# Altium schematic sheet ControllerDSP.SchDoc
size 594 x 420 mm; Address1: Address1; Address2: Address2; Address3: Address3; Address4: Address4; DocumentNumber: АБВГ.123456.001 Э3; SheetNumber: 1; SheetTotal: 5; Scale: 1:1; DocumentType: Схема электрическая принципиальная; FirstReferrence: АБВГ.123456.001
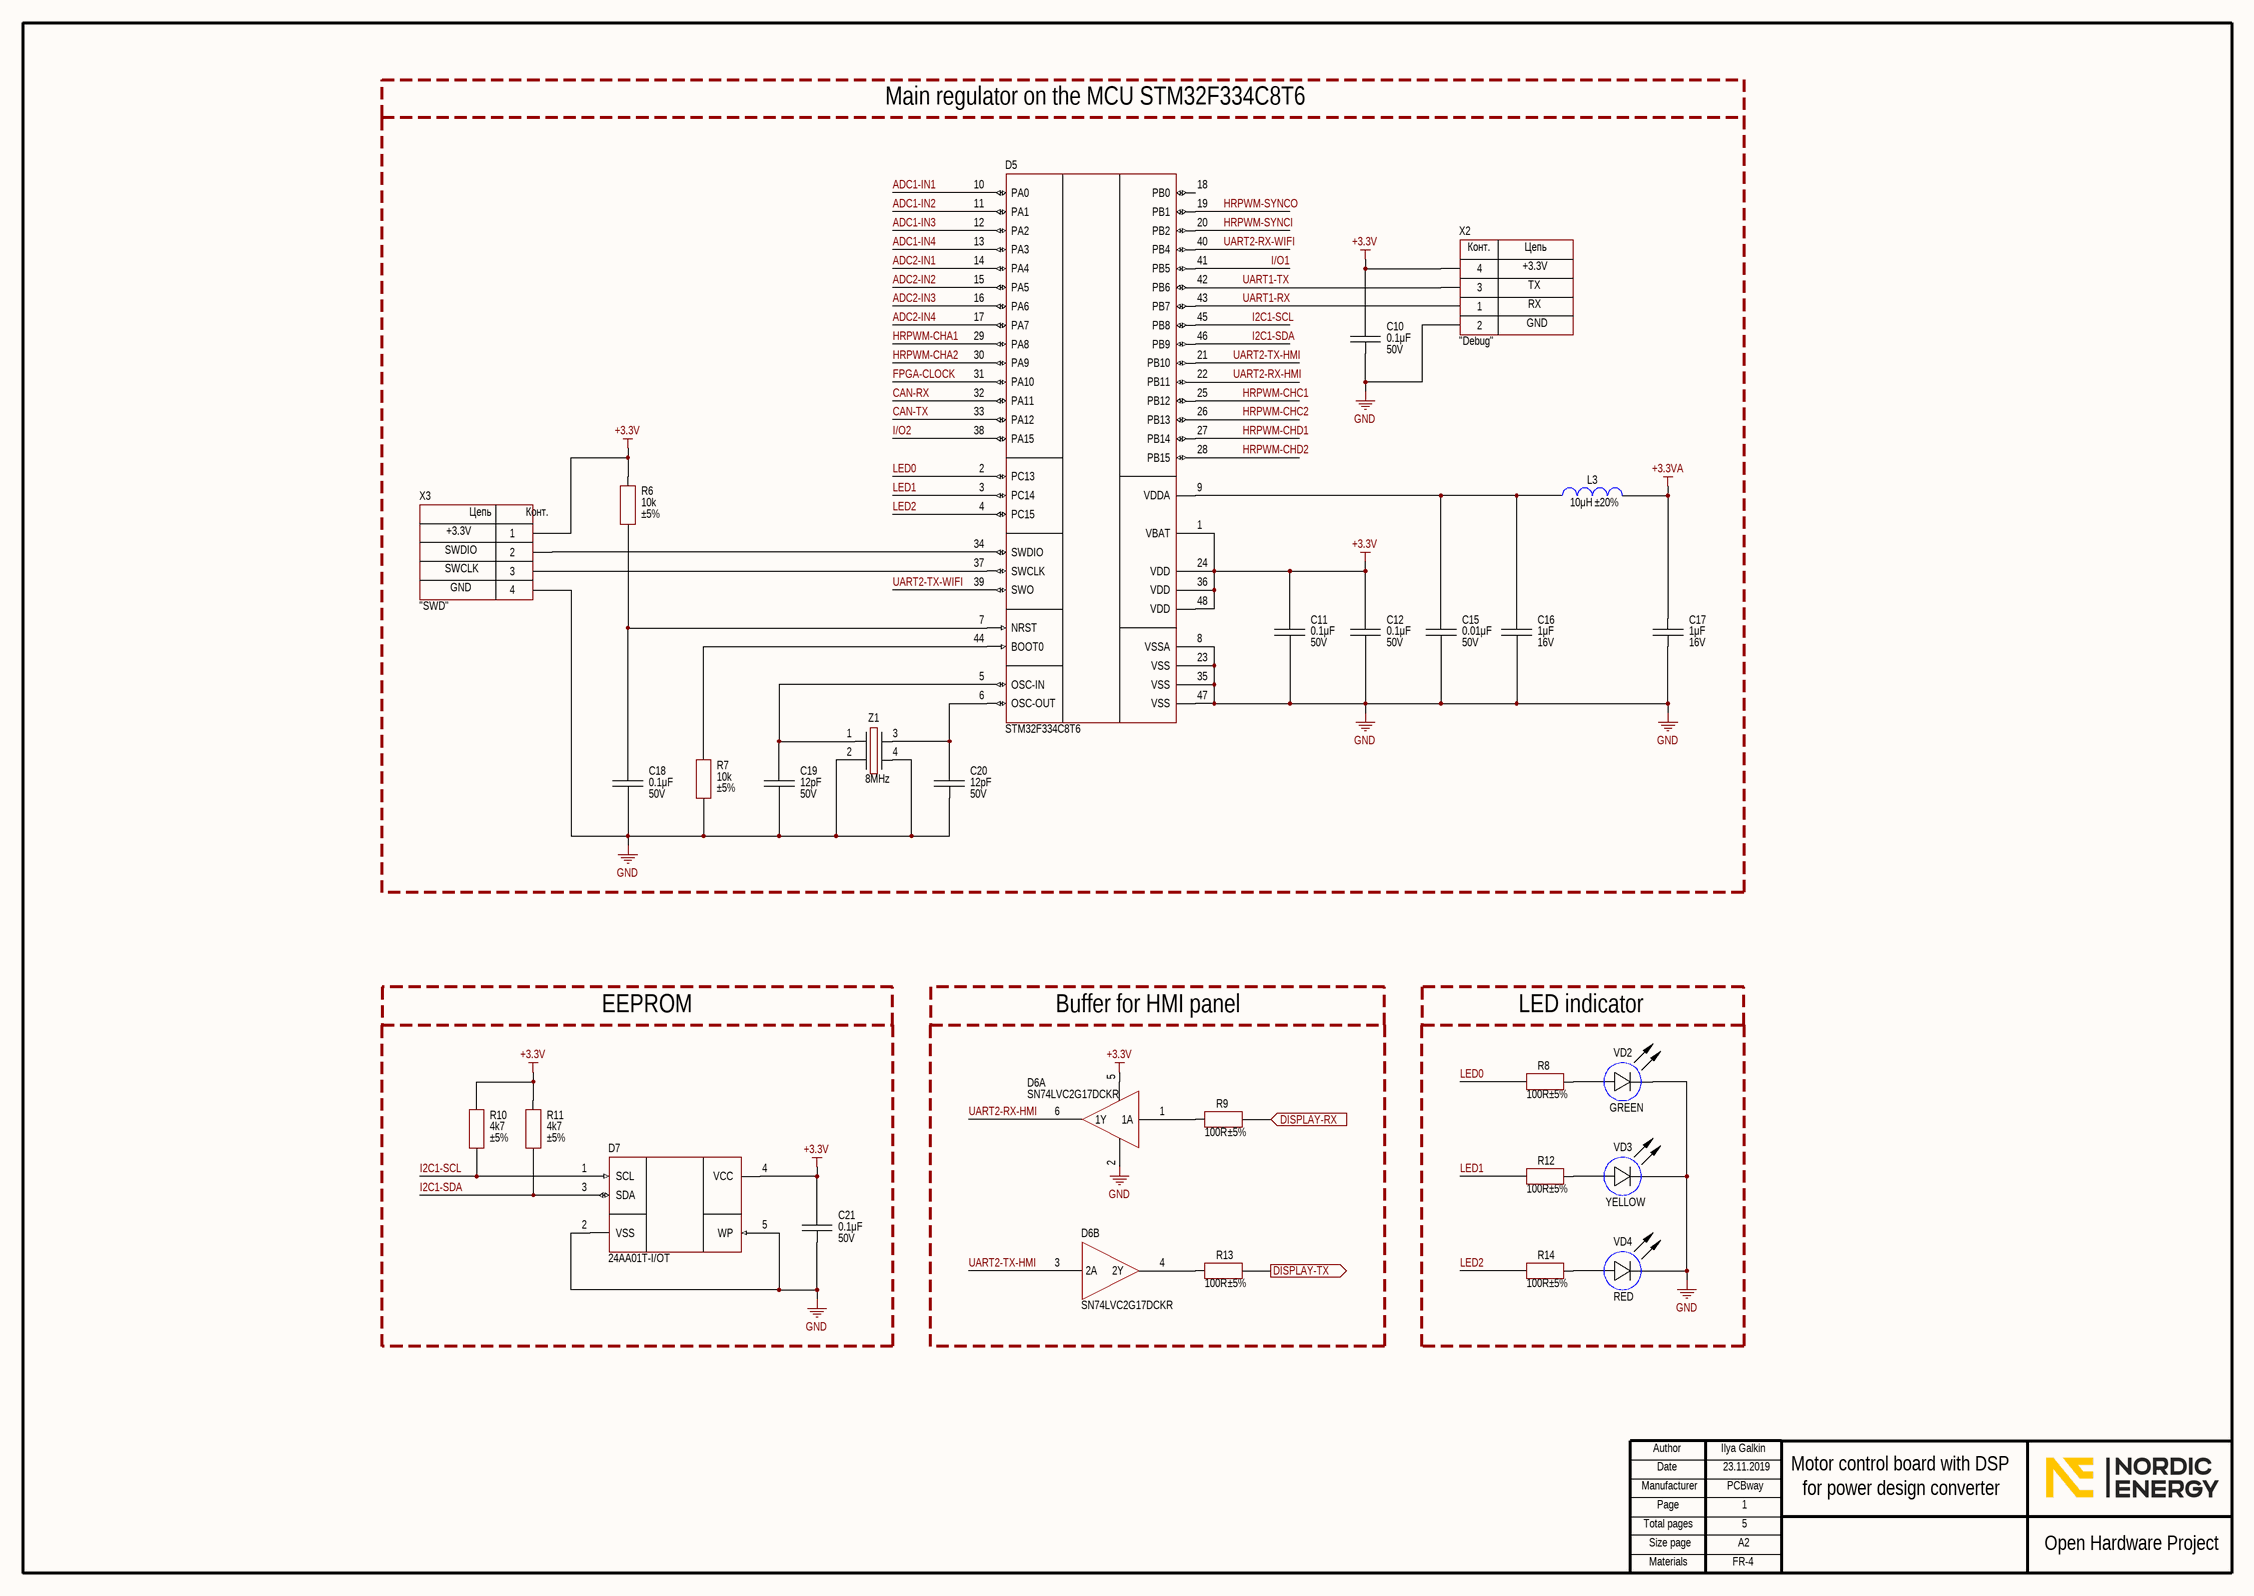
[diagram p0: ControllerDSP.SchDoc]

## Parts
C10  value 0.1μF  Voltage: 50V  [CAP: 0603]
C11  value 0.1μF  Voltage: 50V  [CAP: 0603]
C12  value 0.1μF  Voltage: 50V  [CAP: 0603]
C15  value 0.01μF  Voltage: 50V  [CAP: 0603]
C16  value 1μF  Voltage: 16V  [CAP: 0603]
C17  value 1μF  Voltage: 16V  [CAP: 0603]
C18  value 0.1μF  Voltage: 50V  [CAP: 0603]
C19  value 12pF  Voltage: 50V  [CAP: 0603]
C20  value 12pF  Voltage: 50V  [CAP: 0603]
C21  value 0.1μF  Voltage: 50V  [CAP: 0603]
D5  (no value)  [48-LQFP]
D6  (no value)  [SC70-6]  (parts A,B of 2)
D7  PartNumber: 24AA01T-I/OT  [SOT23-5]
L3  value 10μH  Tolerance: ±20%  [IND: 0603]
R6  value 10k  Tolerance: ±5%  [RES: 0603]
R7  value 10k  Tolerance: ±5%  [RES: 0603]
R8  value 100R  Tolerance: ±5%  [RES: 0603]
R9  value 100R  Tolerance: ±5%  [RES: 0603]
R10  value 4k7  Tolerance: ±5%  [RES: 0603]
R11  value 4k7  Tolerance: ±5%  [RES: 0603]
R12  value 100R  Tolerance: ±5%  [RES: 0603]
R13  value 100R  Tolerance: ±5%  [RES: 0603]
R14  value 100R  Tolerance: ±5%  [RES: 0603]
VD2  Color: GREEN  [LED: 0603G]
VD3  Color: YELLOW  [LED: 0603Y]
VD4  Color: RED  [LED: 0603R]
X2  CommentText: "Debug"  [CON: PBD-4]
X3  CommentText: "SWD"  [CON: SM04B-GHS]
Z1  Frequency: 8MHz  [OSC: 3225]

## Blocks framed on the sheet
Main regulator on the MCU STM32F334C8T6: C10-C12 C15-C20 D5 L3 R6 R7 X2 X3 Z1
EEPROM: C21 D7 R10 R11
Buffer for HMI panel: D6 R9 R13
LED indicator: R8 R12 R14 VD2-VD4

## Ports
DISPLAY-RX (in), DISPLAY-TX (out)

## Nets
+3.3V: C10.2 C11.2 C12.2 C21.2 D5.1(VBAT) D5.24(VDD) D5.36(VDD) D5.48(VDD) D6.5 D7.4(VCC) R6.2 R10.2 R11.2 X2.4 X3.1
+3.3VA: C17.2 L3.1
GND: C10.1 C11.1 C12.1 C15.1 C16.1 C17.1 C18.1 C19.1 C20.1 C21.1 D5.8(VSSA) D5.23(VSS) D5.35(VSS) D5.47(VSS) D6.2 D7.2(VSS) D7.5(WP) R7.1 VD2.2(C) VD3.2(C) VD4.2(C) X2.2 X3.4 Z1.2 Z1.4
ADC1-IN1: D5.10(PA0)
ADC1-IN2: D5.11(PA1)
ADC1-IN3: D5.12(PA2)
ADC1-IN4: D5.13(PA3)
ADC2-IN1: D5.14(PA4)
ADC2-IN2: D5.15(PA5)
ADC2-IN3: D5.16(PA6)
ADC2-IN4: D5.17(PA7)
CAN-RX: D5.32(PA11)
CAN-TX: D5.33(PA12)
DISPLAY-RX: R9.2 ; port DISPLAY-RX
DISPLAY-TX: R13.2 ; port DISPLAY-TX
FPGA-CLOCK: D5.31(PA10)
HRPWM-CHA1: D5.29(PA8)
HRPWM-CHA2: D5.30(PA9)
HRPWM-CHC1: D5.25(PB12)
HRPWM-CHC2: D5.26(PB13)
HRPWM-CHD1: D5.27(PB14)
HRPWM-CHD2: D5.28(PB15)
HRPWM-SYNCI: D5.20(PB2)
HRPWM-SYNCO: D5.19(PB1)
I2C1-SCL: D5.45(PB8) D7.1(SCL) R10.1
I2C1-SDA: D5.46(PB9) D7.3(SDA) R11.1
I/O1: D5.41(PB5)
I/O2: D5.38(PA15)
LED0: D5.2(PC13) R8.1
LED1: D5.3(PC14) R12.1
LED2: D5.4(PC15) R14.1
UART1-RX: D5.43(PB7) X2.1
UART1-TX: D5.42(PB6) X2.3
UART2-RX-HMI: D5.22(PB11) D6.6(1Y)
UART2-RX-WIFI: D5.40(PB4)
UART2-TX-HMI: D5.21(PB10) D6.3(2A)
UART2-TX-WIFI: D5.39(SWO)
NetC15_2: C15.2 C16.2 D5.9(VDDA) L3.2
NetC18_2: C18.2 D5.7(NRST) R6.1
NetC19_2: C19.2 D5.5(OSC-IN) Z1.1
NetC20_2: C20.2 D5.6(OSC-OUT) Z1.3
NetD5_34: D5.34(SWDIO) X3.2
NetD5_37: D5.37(SWCLK) X3.3
NetD5_44: D5.44(BOOT0) R7.2
NetD6_1: D6.1(1A) R9.1
NetD6_4: D6.4(2Y) R13.1
NetR8_2: R8.2 VD2.1(A)
NetR12_2: R12.2 VD3.1(A)
NetR14_2: R14.2 VD4.1(A)

Not connected (* = marked no-connect by the designer): D5 18(PB0)

## Notes on the sheet
- SWDIO
- +3.3V
- SWCLK
- GND
- Ilya Galkin
- 23.11.2019
- PCBway
- 1
- Motor control board with DSP
- for power design converter
- 5
- FR-4
- Author
- Manufacturer
- Date
- Page
- Total pages
- Size page
- A2
- Open Hardware Project
- Materials
- (in symbol Connector_SM04B) Цепь; Конт.
- (in symbol Standard_Debug) Конт.; Цепь; +3.3V; TX; RX; GND

## Library data of the parts
C10-C12 C18 C21 = Ceramic_0603: Manufacturer: Samsung; PartNumber: CL10B104KB8NNNC; ValueManufacturerPartNumber: Ceramic capacitor, 0.1μF, X7R, ±10%, 50V, 0603, -55...+125°C; TypeCapacitor: Ceramic capacitor; Tolerance: ±10%; TypeDielectric: X7R; Package: 0603; HelpURL: https://www.digikey.com/product-detail/en/samsung-electro-mechanics/CL10B104KB8NNNC/1276-1000-1-ND/3889086; Temperature: -55...+125°C
C15 = Ceramic_0603: Manufacturer: Samsung; PartNumber: CL10B103KB8NNNC; ValueManufacturerPartNumber: Ceramic capacitor, 0.01μF, X7R, ±10%, 50V, 0603, -55...+125°C; TypeCapacitor: Ceramic capacitor; Tolerance: ±10%; TypeDielectric: X7R; Package: 0603; HelpURL: https://www.digikey.com/product-detail/en/samsung-electro-mechanics/CL10B103KB8NNNC/1276-1009-1-ND/3889095; Temperature: -55...+125°C
C16 C17 = Ceramic_0603: Manufacturer: Samsung; PartNumber: CL10B105KO8NNNC; ValueManufacturerPartNumber: Ceramic capacitor, 1μF, X7R, ±10%, 16V, 0603, -55...+125°C; TypeCapacitor: Ceramic capacitor; Tolerance: ±10%; TypeDielectric: X7R; Package: 0603; HelpURL: https://www.digikey.com/product-detail/en/samsung-electro-mechanics/CL10B105KO8NNNC/1276-1019-1-ND/3889105; Temperature: -55...+125°C
C19 C20 = Ceramic_0603: Manufacturer: Samsung; PartNumber: CL10C120JB8NNNC; ValueManufacturerPartNumber: Ceramic capacitor, 12pF, NPO, ±10%, 50V, 0603, -55...+125°C; TypeCapacitor: Ceramic capacitor; Tolerance: ±10%; TypeDielectric: NPO; Package: 0603; HelpURL: https://www.digikey.com/product-detail/en/samsung-electro-mechanics/CL10C120JB8NNNC/1276-1254-1-ND/3889340; Temperature: -55...+125°C
D5 = STM32F334C8T6: Cortex-M4; Manufacturer: STMicroelectronics; ValueManufacturerPartNumber: IC microcontroller, 32-Bit, Cortex-M4, 72MHz, 64KB, 12KB, 2...3.6V, -40...+85°C, 48-LQFP; Supply: 2...3.6V; Speed: 72MHz; CoreSize: 32-Bit; MemoryROM: 64KB; MemoryRAM: 12KB; HelpURL: https://www.digikey.com/products/en?keywords=STM32F334C8T6; Package: 48-LQFP; ComponentType: IC microcontroller; Temperature: -40...+85°C; CoreProcessor: Cortex-M4; PartNumber: STM32F334C8T6
D6 = SN74LVC2G17DCKR: Buffer; Manufacturer: Texas Instruments; ValueManufacturerPartNumber: IC logic buffer, 1.65...5.5V, -40...+125°C, SC-70-6; Supply: 1.65...5.5V; HelpURL: https://www.digikey.com/product-detail/en/texas-instruments/SN74LVC2G17DCKR/296-13013-1-ND/479736; Package: SC-70-6; ComponentType: IC logic buffer; Temperature: -40...+125°C; PartNumber: SN74LVC2G17DCKR
D7 = 24AA01T: EEPROM; Manufacturer: Microchip Technology; ValueManufacturerPartNumber: IC memory, EEPROM, 1KB (128x8), 400 kHz, I2C, 1.7...5.5V, -40...+85°C, SOT-23-5; Supply: 1.7...5.5V; Speed: 400 kHz; InterfaceData: I2C; MemorySize: 1KB (128x8); HelpURL: https://www.digikey.com/product-detail/en/microchip-technology/24AA01T-I-OT/24AA01T-I-OTCT-ND/857670; Package: SOT-23-5; ComponentType: IC memory; Temperature: -40...+85°C; MemoryType: EEPROM
L3 = Inductor_0603: Manufacturer: Murata Electronics; PartNumber: LQM18FN100M00D; ValueManufacturerPartNumber: Fixed inductor, 10μH, ±20%, 0603, 50mA, -55...+125°C; TypeInductor: Fixed inductor; MaxCurrent: 50mA; Package: 0603; HelpURL: https://www.digikey.com/product-detail/en/murata-electronics-north-america/LQM18FN100M00D/490-4025-1-ND/1016285; Temperature: -55...+125°C
R6 R7 = Resistor_0603: Manufacturer: Yageo; PartNumber: RC0603JR-0710KL; ValueManufacturerPartNumber: Resistor film, 10k, ±5%, 0603, 0.1W, -55...+125°C; TypeResistor: Resistor film; Power: 0.1W; Package: 0603; HelpURL: https://www.digikey.com/product-detail/en/yageo/RC0603JR-0710KL/311-10KGRCT-ND/729647; Temperature: -55...+125°C
R8 R9 R12-R14 = Resistor_0603: Manufacturer: Yageo; PartNumber: RC0603JR-07100RL; ValueManufacturerPartNumber: Resistor film, 100R, ±5%, 0603, 0.1W, -55...+125°C; TypeResistor: Resistor film; Power: 0.1W; Package: 0603; HelpURL: https://www.digikey.com/product-detail/en/yageo/RC0603JR-07100RL/311-100GRCT-ND/729644; Temperature: -55...+125°C
R10 R11 = Resistor_0603: Manufacturer: Yageo; PartNumber: RC0603JR-074K7L; ValueManufacturerPartNumber: Resistor film, 4k7, ±5%, 0603, 0.1W, -55...+125°C; TypeResistor: Resistor film; Power: 0.1W; Package: 0603; HelpURL: https://www.digikey.com/product-detail/en/yageo/RC0603JR-074K7L/311-4.7KGRCT-ND/729732; Temperature: -55...+125°C
VD2 = LED_single: Manufacturer: Wurth; ValueManufacturerPartNumber: LED, Green, 20mA, 2V, 0603, -55...+150°C; PartNumber: 150060VS75000; TypeDiode: LED; Current: 20mA; VoltageDrop: 2V; Package: 0603; HelpURL: https://www.digikey.com/product-detail/en/wurth-electronics-inc/150060VS75000/732-4980-1-ND/4489904; Temperature: -55...+150°C; ColorParameter: Green
VD3 = LED_single: Manufacturer: Wurth; ValueManufacturerPartNumber: LED, Yellow, 20mA, 2V, 0603, -55...+150°C; PartNumber: 150060YS75000; TypeDiode: LED; Current: 20mA; VoltageDrop: 2V; Package: 0603; HelpURL: https://www.digikey.com/product-detail/en/wurth-electronics-inc/150060YS75000/732-4981-1-ND/4489907; Temperature: -55...+150°C; ColorParameter: Yellow
VD4 = LED_single: Manufacturer: Wurth; ValueManufacturerPartNumber: LED, Red, 20mA, 2V, 0603, -55...+150°C; PartNumber: 150060RS55040; TypeDiode: LED; Current: 20mA; VoltageDrop: 2V; Package: 0603; HelpURL: https://www.digikey.com/product-detail/en/w-rth-elektronik/150060RS55040/732-12015-1-ND/8557225; Temperature: -55...+150°C; ColorParameter: Red
X2 = Standard_Debug: Manufacturer: Connfly; ValueManufacturerPartNumber: Connector, 4pin, 2.54mm, 500VAC, 3A; PartNumber: PBD-4; TypeConnector: Connector; VoltageMax: 500VAC; Pitch: 2.54mm; CurrentMax: 3A; Multichannel: 4pin; HelpURL: https://www.chipdip.ru/product/pbd-4
X3 = Connector_SM04B: Manufacturer: JST; ValueManufacturerPartNumber: Connector, 4pin, 1.25mm, 50VDC, 1A; PartNumber: SM04B-GHS; VoltageMax: 50VDC; Pitch: 1.25mm; CurrentMax: 1A; Multichannel: 4pin; HelpURL: https://www.digikey.com/product-detail/en/jst-sales-america-inc/SM04B-GHS-TB-LF-SN/455-1566-1-ND/807834; TypeConnector: Connector
Z1 = Crystal_3225: Manufacturer: Diodes Incorporated; PartNumber: FL0800008Q; ValueManufacturerPartNumber: Crystal, 8MHz, 12pF, ±30ppm, case 3225, -40...+85°C; LoadCapacitance: 12pF; Tolerance: ±30ppm; Package: case 3225; HelpURL: https://www.digikey.com/product-detail/en/diodes-incorporated/FL0800008Q/FL0800008QDICT-ND/9952912; Temperature: -40...+85°C; TypeOscilator: Crystal